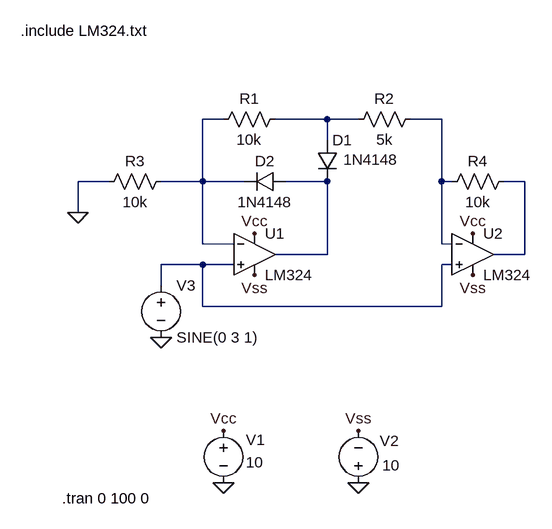
[diagram p0: schematic Circuito_3.asc]
Circuito_3.asc, the LTspice schematic file:
Version 4
SHEET 1 884 680
WIRE -32 32 -64 32
WIRE 128 32 48 32
WIRE 176 32 128 32
WIRE 304 32 256 32
WIRE 128 64 128 32
WIRE -208 128 -256 128
WIRE -64 128 -64 32
WIRE -64 128 -128 128
WIRE 0 128 -64 128
WIRE 128 128 64 128
WIRE 304 128 304 32
WIRE 320 128 304 128
WIRE 432 128 400 128
WIRE -256 176 -256 128
WIRE -64 224 -64 128
WIRE -16 224 -64 224
WIRE 304 224 304 128
WIRE 320 224 304 224
WIRE 128 240 128 128
WIRE 128 240 48 240
WIRE 432 240 432 128
WIRE 432 240 384 240
WIRE -64 256 -128 256
WIRE -16 256 -64 256
WIRE 320 256 304 256
WIRE -128 288 -128 256
WIRE -64 320 -64 256
WIRE 304 320 304 256
WIRE 304 320 -64 320
FLAG -256 176 0
FLAG -32 592 0
FLAG 176 592 0
FLAG -32 512 Vcc
FLAG 176 512 Vss
FLAG 352 272 Vss
FLAG 16 272 Vss
FLAG 16 208 Vcc
FLAG 352 208 Vcc
FLAG -128 368 0
SYMBOL OpAmps\\opamp2 16 176 R0
SYMATTR InstName U1
SYMATTR Value LM324
SYMBOL OpAmps\\opamp2 352 176 R0
SYMATTR InstName U2
SYMATTR Value LM324
SYMBOL res 64 16 R90
WINDOW 0 0 56 VBottom 2
WINDOW 3 32 56 VTop 2
SYMATTR InstName R1
SYMATTR Value 10k
SYMATTR SpiceLine tol=1
SYMBOL res 272 16 R90
WINDOW 0 0 56 VBottom 2
WINDOW 3 32 56 VTop 2
SYMATTR InstName R2
SYMATTR Value 5k
SYMATTR SpiceLine tol=1
SYMBOL res -112 112 R90
WINDOW 0 0 56 VBottom 2
WINDOW 3 32 56 VTop 2
SYMATTR InstName R3
SYMATTR Value 10k
SYMATTR SpiceLine tol=1
SYMBOL res 416 112 R90
WINDOW 0 0 56 VBottom 2
WINDOW 3 32 56 VTop 2
SYMATTR InstName R4
SYMATTR Value 10k
SYMATTR SpiceLine tol=1
SYMBOL diode 112 64 R0
WINDOW 3 41 30 Left 2
SYMATTR Value 1N4148
SYMATTR InstName D1
SYMBOL diode 64 112 R90
WINDOW 0 0 32 VBottom 2
WINDOW 3 32 32 VTop 2
SYMATTR InstName D2
SYMATTR Value 1N4148
SYMBOL voltage -32 496 R0
WINDOW 0 35 30 Left 2
WINDOW 3 35 64 Left 2
WINDOW 123 0 0 Left 0
WINDOW 39 0 0 Left 0
SYMATTR InstName V1
SYMATTR Value 10
SYMBOL voltage 176 608 R180
WINDOW 0 -62 81 Left 2
WINDOW 3 -64 43 Left 2
WINDOW 123 0 0 Left 0
WINDOW 39 0 0 Left 0
SYMATTR InstName V2
SYMATTR Value 10
SYMBOL voltage -128 272 R0
WINDOW 123 0 0 Left 0
WINDOW 39 0 0 Left 0
SYMATTR InstName V3
SYMATTR Value SINE(0 3 1)
TEXT -280 616 Left 2 !.tran 0 100 0
TEXT -344 -104 Left 2 !.include LM324.txt

The netlist it stands for:
* Circuito_3.asc
XU1 N006 N001 Vcc Vss N004 LM324  ; pins In+ In- V+ V- OUT
XU2 N006 N003 Vcc Vss N005 LM324  ; pins In+ In- V+ V- OUT
R1 N002 N001 10k tol=1
R2 N003 N002 5k tol=1
R3 N001 0 10k tol=1
R4 N005 N003 10k tol=1
D1 N002 N004 1N4148
D2 N004 N001 1N4148
V1 Vcc 0 10
V2 0 Vss 10
V3 N006 0 SINE(0 3 1)
.model D D
.lib standard.dio
.tran 0 100 0
.include LM324.txt
.backanno
.end